# EAGLE design KickerBoost (EAGLE 9.6.2)
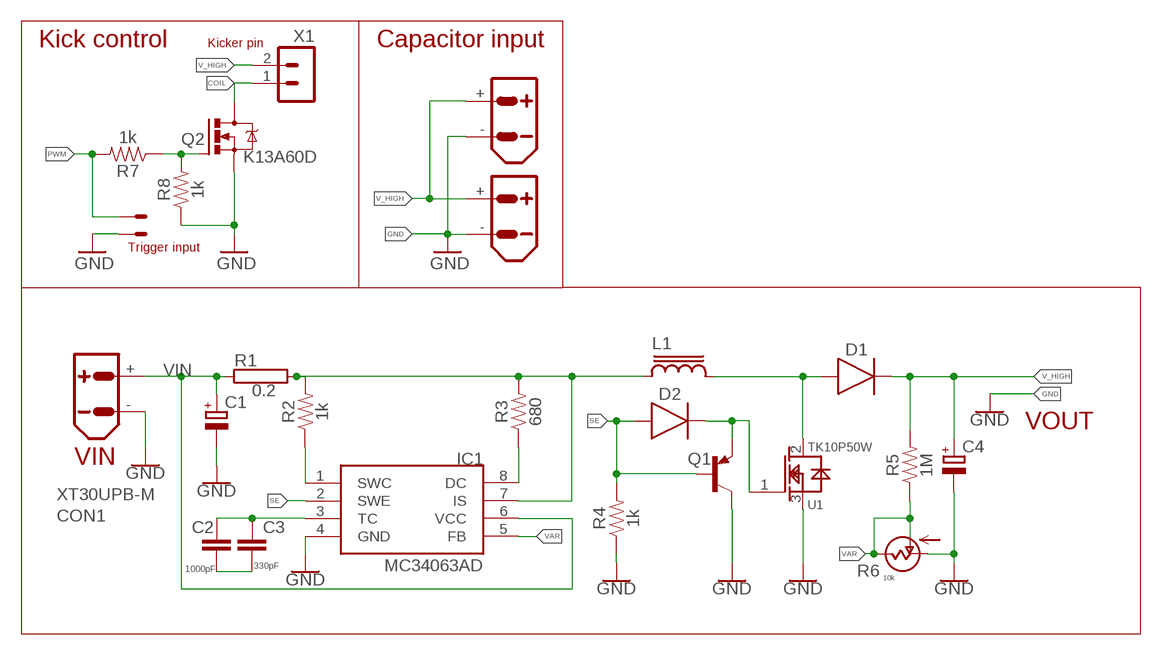
[diagram p0: schematic, sheet 1]

## Parts
C1  CPOL-EUE5-8.5  [E5-8,5]
C2  1000pF  0.1UF-0603-25V-(+80/-20%)  [0603]
C3  330pF  0.1UF-0603-25V-(+80/-20%)  [0603]
C4  CPOL-EUE5-10.5  [E5-10,5]
CON1  XT30UPB-M  [XT30UPB-M]
CON4  XT30UPB-M  [XT30UPB-M]
CON5  XT30UPB-M  [XT30UPB-M]
D1  MRA4007T3G  DIODE_MRA4007T3G_SMA  [DIOM5226X290N]
D2  MRA4007T3G  DIODE_MRA4007T3G_SMA  [DIOM5226X290N]
IC1  MC34063AD  [SOIC8]
L1  CDRH127/LD  [CDRH127/LD]
Q1  BCX71SMD  [SOT23]
Q2  K13A60D  [TO220BV]
R1  0.2  RKH208-8  [KH208-8]
R2  1k  1KOHM-0603-1/10W-1%  [0603]
R3  680  1KOHM-0603-1/10W-1%  [0603]
R4  1k  1KOHM-0603-1/10W-1%  [0603]
R5  1M  1KOHM-0603-1/10W-1%  [0603]
R6  10K  POTTRS64W  [S64W]
R7  1k  1KOHM-0603-1/10W-1%  [0603]
R8  1k  1KOHM-0603-1/10W-1%  [0603]
U1  TK10P50W  [TK10P50W]
X1  VH2  B2P-VH-FB-B  [B2P-VH-FB-B]
X2  HX2  JST-XH-02-PIN-LONG-PAD  [JST-XH-02-PACKAGE-LONG-PAD]

## Nets
COIL: Q2.D X1.1
GND: C1.- C4.- CON1.- CON4.- CON5.- IC1.4(GND) Q1.3(C) Q2.S R4.1 R6.A(VDD) R8.1 U1.3(SOURCE) X2.2
N$1: C2.2 C3.2
N$2: Q2.G R7.1 R8.2
N$3: D2.1(C) Q1.2(E) U1.1(GATE)
N$4: C2.1 C3.1 IC1.3(TC)
N$6: IC1.1(SWC) R2.1
N$7: IC1.8(DC) R3.1
PWM: R7.2 X2.1
SE: D2.2(A) IC1.2(SWE) Q1.1(B) R4.2
V$4: IC1.7(IS) L1.1 R1.2 R2.2 R3.2
V$5: D1.2(A) L1.2 U1.2(DRAIN)
V_HIGH: C4.+ CON4.+ CON5.+ D1.1(C) R5.2 X1.2
VAR: IC1.5(FB) R5.1 R6.E(VSS) R6.S(OUT)
VIN: C1.+ CON1.+ IC1.6(VCC) R1.1

## Notes on the sheet
- Kick control | Kicker pin | Capacitor input
- Trigger input
- VOUT
- VIN
- 10k

## Library data of the parts
C1 C4 = rcl:CPOL-EU: POLARIZED CAPACITOR, European symbol; SPICEPREFIX: C
C2 C3 = SparkFun-Capacitors:0.1UF: 0.1µF ceramic capacitors A capacitor is a passive two-terminal electrical component used to store electrical energy temporarily in an electric field.; PROD_ID: CAP-00810; VALUE: 0.1uF
CON1 CON4 CON5 = amass:XT30: AMASS XT30 connector Store in Japan AMASS XT30 connector <https://szc.jp/ams-xt30>
D1 D2 = Diode:DIODE_: Diode Rectifier - Popular parts; CATEGORY: Diode; DESCRIPTION: DIODE GEN PURP 1KV 1A SMA; MANUFACTURER: ON Semiconductor; SUB-CATEGORY: Rectifier
IC1 = mc34063:MC34063
L1 = inductor-sumida:CDRH127/LD: Power Inductor
Q1 = transistor-pnp:BCX71SMD: PNP Transistor
Q2 = K13A60D:K13A60D: HEXFET Power MOSFET
R1 = resistor-power:R: Power Resitor; OC_FARNELL: unknown; OC_NEWARK: unknown
R2 R4 R7 R8 = SparkFun-Resistors:1KOHM: 1kΩ resistor A resistor is a passive two-terminal electrical component that implements electrical resistance as a circuit element. Resistors act to reduce current flow, and, at the same time, act to lower voltage levels within circuits. - Wikipedia; PROD_ID: RES-07856
R3 R5 = SparkFun-Resistors:1KOHM: 1kΩ resistor A resistor is a passive two-terminal electrical component that implements electrical resistance as a circuit element. Resistors act to reduce current flow, and, at the same time, act to lower voltage levels within circuits. - Wikipedia; PROD_ID: RES-07856; VALUE: 1k
R6 = Values of parts:POTTR: POTENTIOMETER
U1 = TK10P50W:TK10P50W
X1 = con-JST VH:B2P-VH: JST VH Series header 3.96mm pitch disconnectable crimp style connectors, vertical (side entry type), 2 pins
X2 = JST XH Connectors:JST-XH-02-PIN: JST XH Connector 2 Pin Wire to board connector. Pitch: 2,54 mm, (0.100") Number of pins: 2 Created by Rembrandt Electronics www.rembrandtelectronics.com

## Board
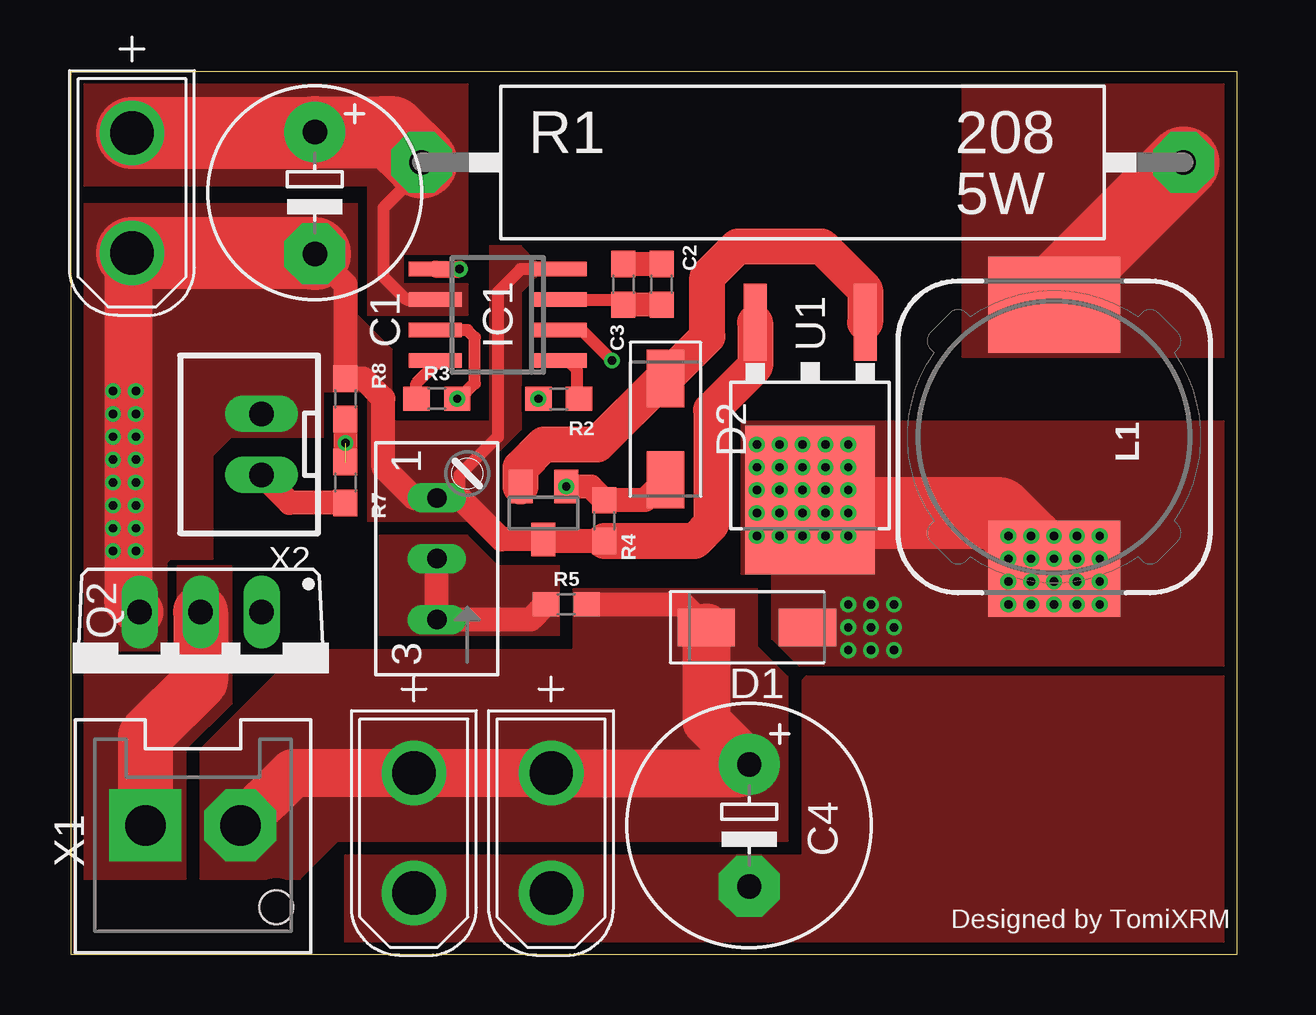
[diagram p1: board, top side]
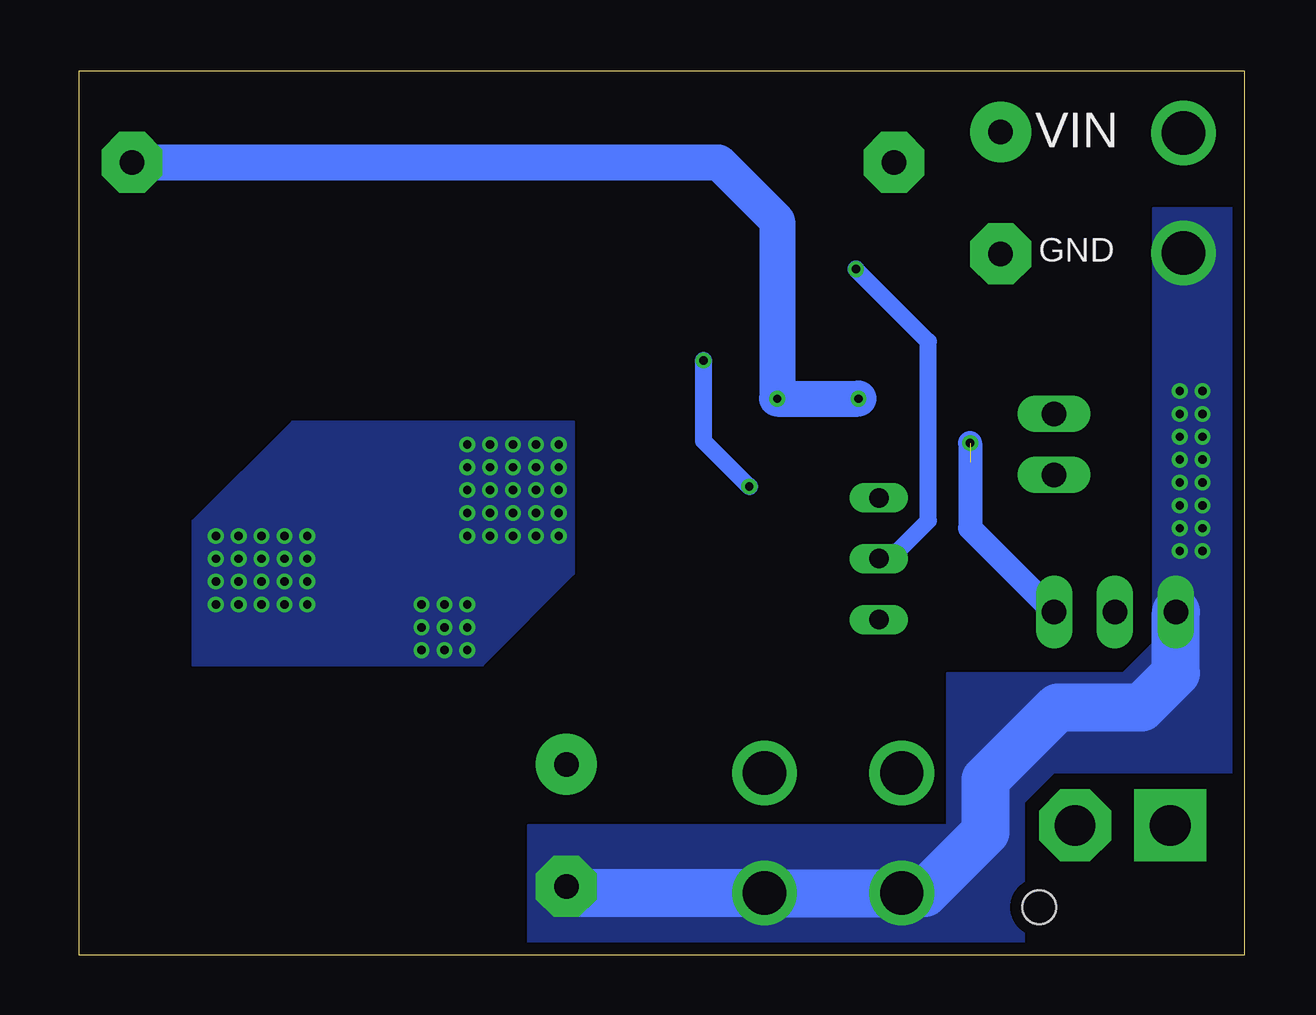
[diagram p2: board, bottom side, seen from below]

Size 48.58 x 36.83 mm. Coordinates in mm from the lower left corner, seen from the top.
Outline: 0,0 0,36.83 48.58,36.83 48.58,0 0,0
Copper layers (1*16): Top 0.035mm / dielectric 1.6mm / Bottom 0.035mm
Design rules "Elecrow_2-layer_PCB_eagle_rule": minimum track width 6mil, minimum drill 12mil, track to track 6mil, track to pad 6mil, pad to pad 6mil, via to via 8mil, smd to smd 0mil, copper to edge 20mil, drill to drill 10mil, minimum pad ring 6mil, minimum via ring 6mil, stop-mask expansion 0mil, vias tented up to drill 100mil, thermal gap 10mil

### Footprints (pad centres in the part's own frame; a part is rotated, then mirrored left to right if it is on the bottom)
E5-8,5 = drill 1.016 pad 2.54: + -2.54,0 | drill 1.016 pad 2.54 octagon: - 2.54,0
0603 = smd 1.1 x 1: 1 -0.85,0; 2 0.85,0
E5-10,5 = drill 1.016 pad 2.54: + -2.54,0 | drill 1.016 pad 2.54 octagon: - 2.54,0
XT30UPB-M = drill 1.8: + 2.5,0; - -2.5,0
DIOM5226X290N = smd 2.392 x 1.565: 1 -2.108,0; 2 2.108,0
SOIC8 = smd 0.6 x 2.2: 1 -1.905,-2.6; 2 -0.635,-2.6; 3 0.635,-2.6; 4 1.905,-2.6; 5 1.905,2.6; 6 0.635,2.6; 7 -0.635,2.6; 8 -1.905,2.6
CDRH127/LD = smd 4 x 5.5: 1 -5.5,0; 2 5.5,0
SOT23 = smd 1 x 1.4: 1 -0.95,-1.1; 2 0.95,-1.1; 3 0,1.1
TO220BV = drill 1.016 long: D 0,-2.54; G -2.54,-2.54; S 2.54,-2.54
KH208-8 = drill 1.016 pad 2.54 octagon: 1 -15.875,0; 2 15.875,0
S64W = drill 0.813 long: A 2.54,1.27; E -2.54,1.27; S 0,1.27
TK10P50W = smd 0.97 x 3.2: 1 -2.29,-4.45; 3 2.29,-4.45 | smd 5.4 x 6.2: 2 0,2.95
B2P-VH-FB-B = drill 1.7 pad 3 square: 1 -1.98,0 | drill 1.7 pad 3 octagon: 2 1.98,0 | hole 1.4: 3.48,-3.4
JST-XH-02-PACKAGE-LONG-PAD = drill 1.016 long: 1 -1.27,0; 2 1.27,0

### Placement (x,y rotation side)
C1  10.16,31.75 270 top
C2  24.61,27.94 90 top
C3  23.02,27.94 90 top
C4  28.26,5.4 270 top
CON1  2.54,31.75 90 top
CON4  20,5.08 90 top
CON5  14.29,5.08 90 top
D1  28.57,13.65 0 top
D2  24.77,21.91 270 top
IC1  17.78,26.67 90 top
L1  40.96,21.59 270 top
Q1  19.68,18.41 180 top
Q2  5.4,11.75 180 top
R1  30.48,33.02 0 top
R2  20.32,23.18 180 top
R3  15.24,23.18 0 top
R4  22.23,18.1 90 top
R5  20.64,14.61 0 top
R6  16.51,16.51 90 top
R7  11.43,19.68 270 top
R8  11.43,23.18 270 top
U1  30.8,21.91 180 top
X1  5.08,5.4 0 top
X2  7.94,21.27 90 top

### Tracks (layer width: path | path; a pad name or v marks a point on that pad's centre or on a via)
COIL
  Top 2.3: Q2.D 5.4,11.43 3.1,9.13 X1.1
  pour Top (no thermals): 6.67,16.19 6.67,10.48 4.76,8.57 4.76,3.17 0,3.17 0,12.38 4.45,12.38 4.45,16.19
GND  (via drill 0.35)
  Top 0.152: 2.38,14.76 2.38,20.32
  Top 0.5: IC1.4 18.73,28.57 17.78,27.62 17.78,21.59 16.19,20 16.19,19.05
  Top 1: C1.- 11.43,27.94 R8.1 12.17,24.03 13.02,23.18 13.02,20.32 14.29,19.05 R6.A 16.19,19.05 17.93,17.32 Q1.3 19.75,17.25 R4.1
  Top 1.5: U1.3 28.51,24.54 26.67,22.7 26.67,17.94 25.98,17.25 R4.1
  Top 2: CON1.- 2.38,29.09 2.38,14.76 Q2.S
  Top 3: CON1.- 10.12,29.25 C1.-
  Bottom 0.152: 5.4,10.16 5.24,10.32 2.86,12.7 Q2.S
  Bottom 2: C4.- 27.98,2.58 CON4.- CON5.- 13.34,2.58 10.79,5.12 10.79,7.3 7.78,10.32 5.24,10.32 4.29,10.32 2.86,11.75 Q2.S
  other vias: 2.7,20.64 1.75,20.64 1.75,23.5 1.75,22.54 1.75,21.59 2.7,21.59 2.7,22.54 2.7,23.5 2.7,16.83 1.75,16.83 1.75,19.68 1.75,18.73 1.75,17.78 2.7,17.78 2.7,18.73 2.7,19.68
  pour Top (no thermals): 0,31.27 11.91,31.27 11.91,26.67 13.34,25.24 13.34,22.23 17.78,22.23 17.78,16.83 16.51,18.1 12.38,18.1 12.38,23.5 10.48,23.5 10.48,21.59 6.67,21.59 3.97,18.89 3.97,12.7 0,12.7
  pour Bottom (no thermals): 3.81,31.11 0,31.11 0,7.62 7.94,7.62 9.21,6.35 9.21,0 29.84,0 29.84,5.4 12.38,5.4 12.38,11.75 5.08,11.75 3.81,13.02
  pour Top (no thermals): 19.37,28.89 18.73,29.53 17.46,29.53 17.46,20.64 18.73,21.91 18.73,27.62 19.37,28.26
  pour Top (no thermals): 6.67,21.59 5.87,20.8 5.87,16.51 4.13,16.51 3.49,15.88 3.49,13.81 3.17,13.49 1.91,13.49 1.91,17.78 5.71,21.59
  pour Top (no thermals): 11.43,4.13 11.43,0 48.42,0 48.42,11.59 30.64,11.59 30.48,11.43 30.48,4.13
N$1
  Top 1: C2.2 C3.2
N$2  (via drill 0.35)  (1 unrouted)
  Top 0.152: 11.43,20.64 v11.43,21.33
  Top 1: R8.2 11.43,20.64
  Bottom 1: v11.43,21.33 11.43,17.78 Q2.G
N$3
  Top 1.5: Q1.2 18.73,20.31 19.7,21.27 21.91,21.27 24.65,24.02 D2.1 26.51,25.76 26.51,28.26 27.78,29.53 31.27,29.53 33.09,27.71 U1.1
N$4
  Top 0.5: IC1.3 22.8,27.3 C3.1
  Top 1: C2.1 C3.1
N$6
  Top 0.152: 21.06,23.29 R2.1
  Top 0.5: IC1.1 20.7,24.77 21.06,24.4 21.06,23.29
N$7
  Top 0.5: IC1.8 15.18,24.6 14.39,23.81 R3.1
PWM
  Top 1: R7.2 9.11,18.84 X2.1
SE  (via drill 0.35)
  Top 0.152: IC1.2 21.27,26.04
  Top 0.5: 21.27,26.04 v22.54,24.77
  Top 1: D2.2 23.91,18.95 R4.2 21.66,19.52 v20.64,19.52
  Bottom 0.7: v22.54,24.77 22.54,21.42 v20.64,19.52
V$4  (via drill 0.35)
  Top 0.152: 15.88,26.04 IC1.7 | R1.2 46.35,32.38 40.64,26.67 40.8,26.51 40.96,26.67 L1.1
  Top 0.5: R3.2 16.19,23.18 16.83,23.81 16.83,25.72 16.51,26.04 15.88,26.04
  Top 3: R1.2 40.64,27.3 40.64,26.67
  Bottom 1.5: R1.2 21.91,33.02 19.47,30.58 R2.2 R3.2
  other vias: 19.47,23.18 16.09,23.18
  pour Top (no thermals): 48.58,36.83 37.15,36.83 37.15,24.92 48.58,24.92
V$5  (via drill 0.35)
  Top 0.152: D1.2 30.16,14.17
  Top 3: L1.2 38.63,18.41 v32.38,18.41 30.16,18.41
  other vias: 32.38,21.27 32.38,20.32 32.38,19.37 32.38,17.46 31.43,18.41 31.43,21.27 31.43,20.32 31.43,19.37 31.43,17.46 30.48,18.41 30.48,21.27 30.48,20.32 30.48,19.37 30.48,17.46 29.53,18.41 29.53,21.27 29.53,20.32 29.53,19.37 29.53,17.46 28.57,18.41 28.57,21.27 28.57,20.32 28.57,19.37 28.57,17.46 39.05,14.61 40.01,14.61 39.05,15.56 40.96,14.61 42.86,14.61 41.91,14.61 40.01,15.56 41.91,17.46 41.91,16.51 40.96,15.56 41.91,15.56 39.05,16.51 40.01,16.51 40.96,16.51 39.05,17.46 40.96,17.46 40.01,17.46 42.86,15.56 42.86,16.51 42.86,17.46 34.29,14.61 34.29,13.65 34.29,12.7 33.34,14.61 33.34,13.65 33.34,12.7 32.38,14.61 32.38,13.65 32.38,12.7
  pour Top (no thermals): 48.58,22.23 27.94,22.23 27.94,15.88 29.21,15.88 29.21,13.18 30.32,12.06 48.58,12.06
  pour Bottom (no thermals): 27.94,15.88 27.94,22.23 39.69,22.23 43.81,18.1 43.81,12.06 31.75,12.06
V_HIGH
  Top 0.152: CON4.+ 20.95,7.58
  Top 1: R5.2 25.52,14.61 D1.1
  Top 2: D1.1 26.47,9.73 C4.+ 27.9,7.58 CON4.+ CON5.+ 9.24,7.58 X1.2
  pour Top (no thermals): 20.95,15.24 28.57,15.24 28.57,12.86 29.84,11.59 29.84,4.76 11.11,4.76 9.53,3.17 5.4,3.17 5.4,8.57 9.53,12.7 20.95,12.7
VAR  (via drill 0.35)
  Top 0.7: IC1.5 v16.19,28.57
  Top 1: R5.1 19.15,13.97 R6.E R6.S
  Bottom 0.7: v16.19,28.57 13.18,25.56 13.18,18.1 14.76,16.51 R6.S
  pour Top (no thermals): 20.32,16.19 20.32,13.34 12.86,13.34 12.86,17.46 16.51,17.46 17.78,16.19
VIN
  Top 0.152: 14.92,27.3 IC1.6 | 10.12,34.25 C1.+ | 13.02,34.29 13.34,34.29
  Top 0.5: R1.1 14.61,32.7 13.02,31.11 13.02,28.26 13.97,27.3 14.92,27.3
  Top 3: CON1.+ 10.12,34.25 | R1.1 13.34,34.29 | C1.+ 13.02,34.29
  pour Top (no thermals): 0,36.83 16.51,36.83 16.51,29.21 13.81,29.21 13.81,27.94 16.51,27.94 16.51,26.67 12.38,26.67 12.38,32.07 0,32.07

### Text on the board
tPlace: Designed by TomiXRM
bNames: VIN | GND
tStop: Kicker | Unit | version1.0